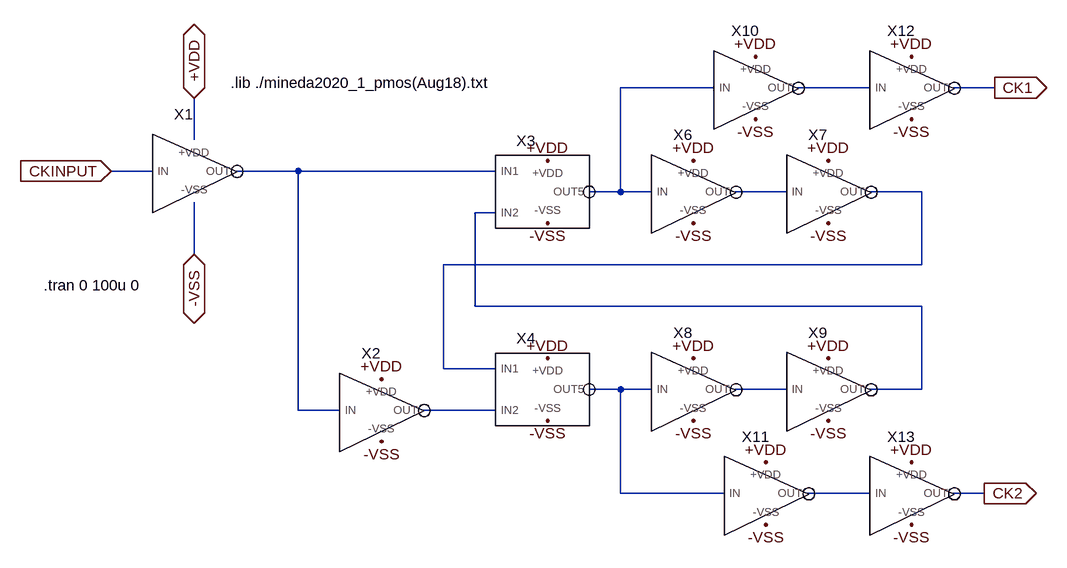
[diagram p0: schematic Non-overlapping-CKGen.asc]
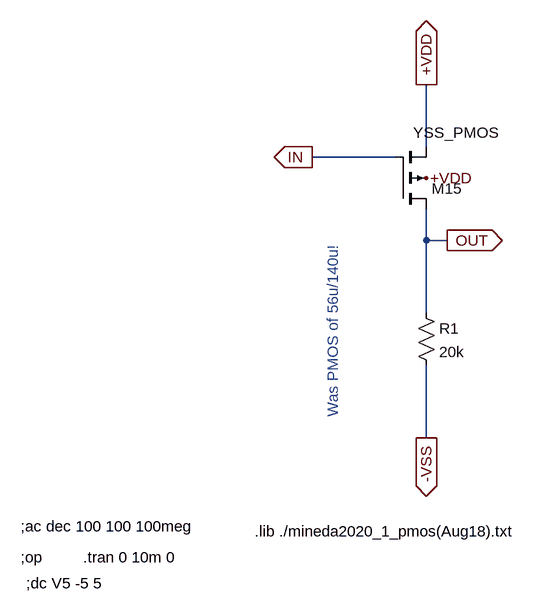
[diagram p1: sub-circuit pmos-inv.asc]
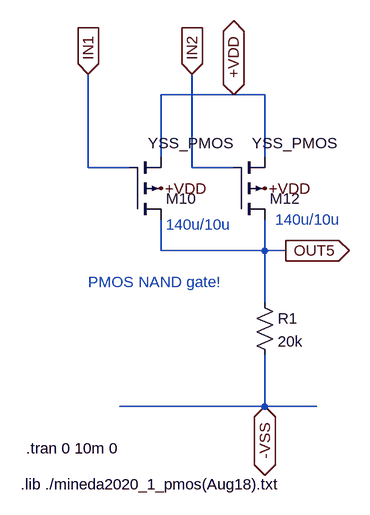
[diagram p2: sub-circuit pmos-nor.asc]
Non-overlapping-CKGen.asc, the LTspice schematic file:
Version 4
SHEET 1 1876 1032
WIRE 1120 16 976 16
WIRE 1360 16 1248 16
WIRE 1552 16 1488 16
WIRE 320 96 320 32
WIRE 256 144 192 144
WIRE 480 144 384 144
WIRE 784 144 480 144
WIRE 976 176 976 16
WIRE 976 176 928 176
WIRE 1024 176 976 176
WIRE 1232 176 1152 176
WIRE 1440 176 1360 176
WIRE 784 208 752 208
WIRE 320 272 320 192
WIRE 1440 288 1440 176
WIRE 1440 288 704 288
WIRE 752 352 752 208
WIRE 1440 352 752 352
WIRE 704 448 704 288
WIRE 784 448 704 448
WIRE 976 480 928 480
WIRE 1024 480 976 480
WIRE 1232 480 1152 480
WIRE 1440 480 1440 352
WIRE 1440 480 1360 480
WIRE 480 512 480 144
WIRE 544 512 480 512
WIRE 784 512 672 512
WIRE 976 640 976 480
WIRE 1136 640 976 640
WIRE 1360 640 1264 640
WIRE 1536 640 1488 640
FLAG 608 464 +VDD
FLAG 608 560 -VSS
FLAG 864 128 +VDD
FLAG 864 432 +VDD
FLAG 864 224 -VSS
FLAG 864 528 -VSS
FLAG 1088 128 +VDD
FLAG 1088 224 -VSS
FLAG 1296 128 +VDD
FLAG 1296 224 -VSS
FLAG 1088 432 +VDD
FLAG 1088 528 -VSS
FLAG 1296 432 +VDD
FLAG 1296 528 -VSS
FLAG 1552 16 CK1
IOPIN 1552 16 Out
FLAG 1536 640 CK2
IOPIN 1536 640 Out
FLAG 1184 -32 +VDD
FLAG 1184 64 -VSS
FLAG 1200 592 +VDD
FLAG 1200 688 -VSS
FLAG 1424 -32 +VDD
FLAG 1424 64 -VSS
FLAG 1424 592 +VDD
FLAG 1424 688 -VSS
FLAG 192 144 CKINPUT
IOPIN 192 144 In
FLAG 320 32 +VDD
IOPIN 320 32 BiDir
FLAG 320 272 -VSS
IOPIN 320 272 BiDir
SYMBOL PMOS-INV 304 144 R0
SYMATTR InstName X1
SYMBOL PMOS-INV 592 512 R0
SYMATTR InstName X2
SYMBOL PMOS-NOR 848 176 R0
SYMATTR InstName X3
SYMBOL PMOS-NOR 848 480 R0
SYMATTR InstName X4
SYMBOL PMOS-INV 1072 176 R0
SYMATTR InstName X6
SYMBOL PMOS-INV 1280 176 R0
SYMATTR InstName X7
SYMBOL PMOS-INV 1072 480 R0
SYMATTR InstName X8
SYMBOL PMOS-INV 1280 480 R0
SYMATTR InstName X9
SYMBOL PMOS-INV 1168 16 R0
SYMATTR InstName X10
SYMBOL PMOS-INV 1184 640 R0
SYMATTR InstName X11
SYMBOL PMOS-INV 1408 16 R0
SYMATTR InstName X12
SYMBOL PMOS-INV 1408 640 R0
SYMATTR InstName X13
TEXT 88 320 Left 2 !.tran 0 100u 0
TEXT 376 8 Left 2 !.lib ./mineda2020_1_pmos(Aug18).txt

pmos-inv.asc, the sub-circuit schematic file:
Version 4
SHEET 1 2296 2968
WIRE 640 -864 640 -960
WIRE 592 -848 464 -848
WIRE 640 -720 640 -768
WIRE 672 -720 640 -720
WIRE 640 -608 640 -720
WIRE 640 -416 640 -528
FLAG 640 -960 +VDD
IOPIN 640 -960 Out
FLAG 640 -416 -VSS
IOPIN 640 -416 Out
FLAG 640 -816 +VDD
FLAG 672 -720 OUT
IOPIN 672 -720 Out
FLAG 464 -848 IN
IOPIN 464 -848 Out
SYMBOL pmos4 592 -768 M180
WINDOW 3 28 118 Left 2
SYMATTR Value YSS_PMOS
SYMATTR InstName M15
SYMATTR Value2 l=10u w=140u ad=1.96n as=1.96n pd=168u ps=168u
SYMBOL res 624 -624 R0
SYMATTR InstName R1
SYMATTR Value 20k
TEXT 24 -192 Left 2 !;dc V5 -5 5
TEXT 376 -272 Left 2 !.lib ./mineda2020_1_pmos(Aug18).txt
TEXT 16 -232 Left 2 !;op
TEXT 16 -280 Left 2 !;ac dec 100 100 100meg
TEXT 112 -232 Left 2 !.tran 0 10m 0
TEXT 496 -448 VLeft 2 ;Was PMOS of 56u/140u!

pmos-nor.asc, the sub-circuit schematic file:
Version 4
SHEET 1 2296 2968
WIRE 976 -912 864 -912
WIRE 1024 -912 976 -912
WIRE 864 -816 864 -912
WIRE 1024 -816 1024 -912
WIRE 752 -800 752 -944
WIRE 816 -800 752 -800
WIRE 912 -800 912 -944
WIRE 976 -800 912 -800
WIRE 864 -672 864 -720
WIRE 1024 -672 1024 -720
WIRE 1024 -672 864 -672
WIRE 1056 -672 1024 -672
WIRE 1024 -592 1024 -672
WIRE 1024 -432 1024 -512
WIRE 1024 -432 800 -432
WIRE 1104 -432 1024 -432
FLAG 1024 -432 -VSS
IOPIN 1024 -432 BiDir
FLAG 1056 -672 OUT5
IOPIN 1056 -672 Out
FLAG 864 -768 +VDD
FLAG 1024 -768 +VDD
FLAG 912 -944 IN2
IOPIN 912 -944 In
FLAG 752 -944 IN1
IOPIN 752 -944 In
FLAG 976 -912 +VDD
IOPIN 976 -912 BiDir
SYMBOL pmos4 816 -720 M180
WINDOW 3 28 118 Left 2
SYMATTR Value YSS_PMOS
SYMATTR InstName M10
SYMATTR Value2 l=10u w=140u ad=0.994n as=0.994n pd=98u ps=98u
SYMBOL pmos4 976 -720 M180
WINDOW 3 28 118 Left 2
SYMATTR Value YSS_PMOS
SYMATTR InstName M12
SYMATTR Value2 l=10u w=140u ad=0.994n as=0.994n pd=98u ps=98u
SYMBOL res 1008 -608 R0
SYMATTR InstName R1
SYMATTR Value 20k
TEXT 648 -312 Left 2 !.lib ./mineda2020_1_pmos(Aug18).txt
TEXT 656 -368 Left 2 !.tran 0 10m 0
TEXT 1040 -720 Left 2 ;140u/10u
TEXT 872 -712 Left 2 ;140u/10u
TEXT 752 -624 Left 2 ;PMOS NAND gate!

The netlist it stands for:
* Non-overlapping-CKGen.asc
XX1 +VDD -VSS CKINPUT N003 pmos-inv
XX2 +VDD -VSS N003 N009 pmos-inv
XX3 N003 N006 +VDD -VSS N001 pmos-nor
XX4 N005 N009 +VDD -VSS N007 pmos-nor
XX6 +VDD -VSS N001 N004 pmos-inv
XX7 +VDD -VSS N004 N005 pmos-inv
XX8 +VDD -VSS N007 N008 pmos-inv
XX9 +VDD -VSS N008 N006 pmos-inv
XX10 +VDD -VSS N001 N002 pmos-inv
XX11 +VDD -VSS N007 N010 pmos-inv
XX12 +VDD -VSS N002 CK1 pmos-inv
XX13 +VDD -VSS N010 CK2 pmos-inv

* block symbol definitions
.subckt pmos-inv +VDD -VSS IN OUT
M15 OUT IN +VDD +VDD YSS_PMOS l=10u w=140u ad=1.96n as=1.96n pd=168u ps=168u
R1 OUT -VSS 20k
;dc V5 -5 5
.lib ./mineda2020_1_pmos(Aug18).txt
;op
;ac dec 100 100 100meg
.tran 0 10m 0
* Was PMOS of 56u/140u!
.ends pmos-inv

.subckt pmos-nor IN1 IN2 +VDD -VSS OUT5
M10 OUT5 IN1 +VDD +VDD YSS_PMOS l=10u w=140u ad=0.994n as=0.994n pd=98u ps=98u
M12 OUT5 IN2 +VDD +VDD YSS_PMOS l=10u w=140u ad=0.994n as=0.994n pd=98u ps=98u
R1 OUT5 -VSS 20k
.lib ./mineda2020_1_pmos(Aug18).txt
.tran 0 10m 0
* 140u/10u
* 140u/10u
* PMOS NAND gate!
.ends pmos-nor

.model NMOS NMOS
.model PMOS PMOS
.lib standard.mos
.tran 0 100u 0
.lib ./mineda2020_1_pmos(Aug18).txt
.backanno
.end